# Altium schematic sheet Power Battery Measurement.SchDoc: Battery Measurement
size 292 x 193 mm; DocumentNumber: 3; SheetNumber: 3; SheetTotal: 40
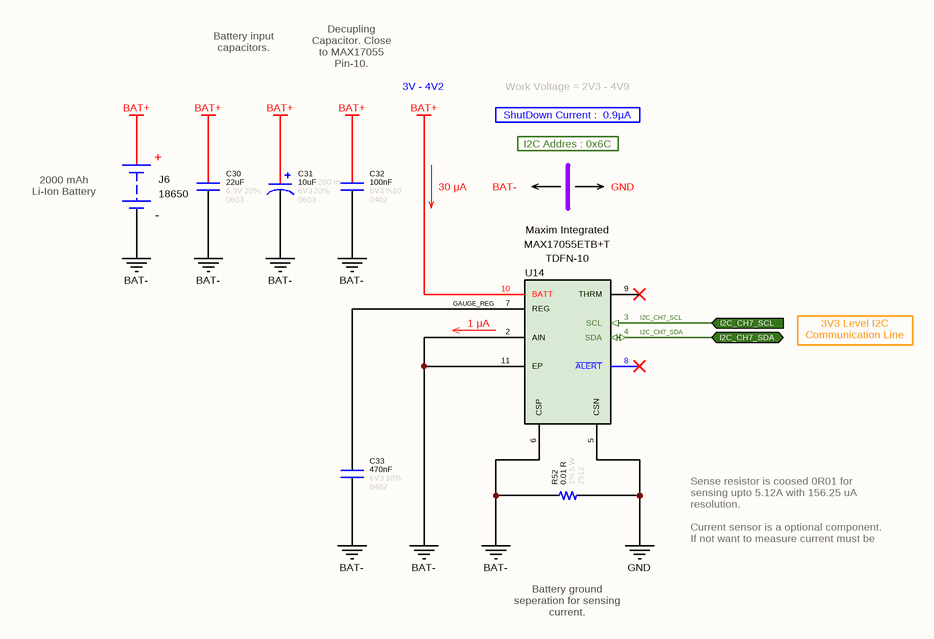
[diagram p0: Power Battery Measurement.SchDoc]

## Parts
C30  value 22uF  Tolerance: 20%  Case: 0603  Voltage: 6.3V  [CAPACITOR_0603]  (hidden comment: Capacitor - 22uF [0603] (Ceramic))
C31  value 10uF  ESR: 200 m  Tolerance: 20%  Case: 0603  Voltage: 6V3  [CAPACITOR_0603_Tantalum]  (hidden comment: Capacitor - 10uF [0603] (Tantalum))
C32  value 100nF  Tolerance: %10  Voltage: 6V3  Case: 0402  [CAPACITOR_0402]  (hidden comment: Capacitor - 100nF [0402] (Ceramic))
C33  value 470nF  Tolerance: 10%  Case: 0402  Voltage: 6V3  [CAPACITOR_0402]  (hidden comment: Capacitor - 470nF [0402] (Ceramic))
J6  Battery Size: 18650  [BATTERY_HOLDER - Bat - V2]  (hidden comment: 54)
R52  value 0.01 R  Tolerance: 1%  Power: 5 W  Case: 2512  [RESISTOR_2512 SHUNT]  (hidden comment: 0R01 - 2512 - %1 - 5W)
U14  Manufacturer Name: Maxim Integrated  [TDFN-10]  (hidden comment: MAX17055ETB+T)

## Ports
I2C_CH7_SCL (in), I2C_CH7_SDA (bidir)

## Nets
BAT+: C30.2 C31.1 C32.2 J6.1(BAT+) U14.10(BATT)
BAT-: C30.1 C31.2 C32.1 C33.1 J6.2(BAT-) R52.2 U14.2(AIN) U14.6(CSP) U14.11(EP)
GND: R52.1 U14.5(CSN)
GAUGE_REG: C33.2 U14.7(REG)
I2C_CH7_SCL: U14.3(SCL) ; port I2C_CH7_SCL
I2C_CH7_SDA: U14.4(SDA) ; port I2C_CH7_SDA

Not connected (* = marked no-connect by the designer): U14 8(~{ALERT})* 9(THRM)*

## Notes on the sheet
- Battery input capacitors.
- Decupling Capacitor. Close to MAX17055 Pin-10.
- 3V - 4V2
- ShutDown Current :  0.9µA
- Work Voltage = 2V3 - 4V9
- (near J6) 2000 mAh
  Li-Ion Battery
- 30 μA
- I2C Addres : 0x6C
- BAT-
- GND
- (near U14) 1 μA
- 3V3 Level I2C
  Communication Line
- Sense resistor is coosed 0R01 for sensing upto 5.12A with 156.25 uA resolution.
  Current sensor is a optional component. If not want to measure current must be connect PACK- to GND.
- Battery ground seperation for sensing current.
- © 2021 All rights reserved.
  This document may not, in whole or in part, be copied, photocopied, reproduced, translated or converted to any electronic or machine readable from without prior written permission of Mehmet Günce Akkoyun.
  Engineer contact : akkoyun@me.com
- Property of
- Engineer :
- Date :
- Size :
- A4
- Time :
- Project :
- Page :
- /
- Customer :
- Product ID :
- Module ID :
- Version :
- File :
- Revision :
- (in symbol Connector - 18650 Battery Holder 2) +; -

## Library data of the parts
C30 = Capacitor - 22uF [0603-6V3]: Multilayer Ceramic Capacitors - SMD - 6V3 22uF X5R 0603 20%; Manufacturer Part Number: GRM188R60J226MEA0D; Manufacturer Name: Murata
C31 = Capacitor - 10uF [0603-6V3] (Tantalium): Capacitor - 10uF [0603] (Tantalium); Manufacturer Name: AVX; Manufacturer Part Number: F380J106MMAAH3; ComponentLink1Description: DataSheet; ComponentLink1URL: https://www.mouser.com.tr/datasheet/2/40/f38-775706.pdf; ComponentLink2Description: Mouser; ComponentLink2URL: https://www.mouser.com.tr/ProductDetail/AVX/F380J106MMAAH3?qs=sGAEpiMZZMtZ1n0r9vR22fixilZl6Mr8zRKleESmvcDFwZ4LSyC6Pg%3D%3D
C32 = Capacitor - 100nF [0402-6V3]: Capacitor - 100nF [0402-6V3] (Ceramic); Manufacturer Name: AVX; Manufacturer Part Number: 04026D104KAT4A; ComponentLink1Description: Mouser; ComponentLink1URL: https://www.mouser.com.tr/ProductDetail/AVX/04026D104KAT4A?qs=sGAEpiMZZMs0AnBnWHyRQPg4iYkCw7IMED%2F4kpqgf7w%3D; ComponentLink2Description: DataSheet; ComponentLink2URL: https://www.mouser.com.tr/datasheet/2/40/cx5r-776519.pdf
C33 = Capacitor - 470 nF [0402-6V3]: Multilayer Ceramic Capacitors - SMD - 6.3V 470nF X7R 0402 10%; Manufacturer Name: AVX; Manufacturer Part Number: 04026C474KAT2A
J6 = Connector - 18650 Battery Holder 2: BATTERY CONTACT CLP 18650 PC PIN; Manufacturer Name: Keystone Electronics; Manufacturer Part Number: 54; Product Type: Battery Holders; RoHS: Yes
R52 = Resistor - 0R01 [2512]: Shunt Resistors - SMD 5 W 0.01 Ohm 1%; Manufacturer Part Number: TLRH3APTTE10L0F; Manufacturer Name: KOA Speer
U14 = IC - MAX17055: IC FUEL GAUGE MODELGAUGE 10TDFN; Minimum Operating Temperature: - 40 C; Product Type: Battery Gauge; Maximum Operating Temperature: + 85 C; Manufacturer Part Number: MAX17055ETB+T; Case: TDFN-10